# Altium schematic sheet dsPIC33_CPU_ETH100_Unit.SchDoc
size A1
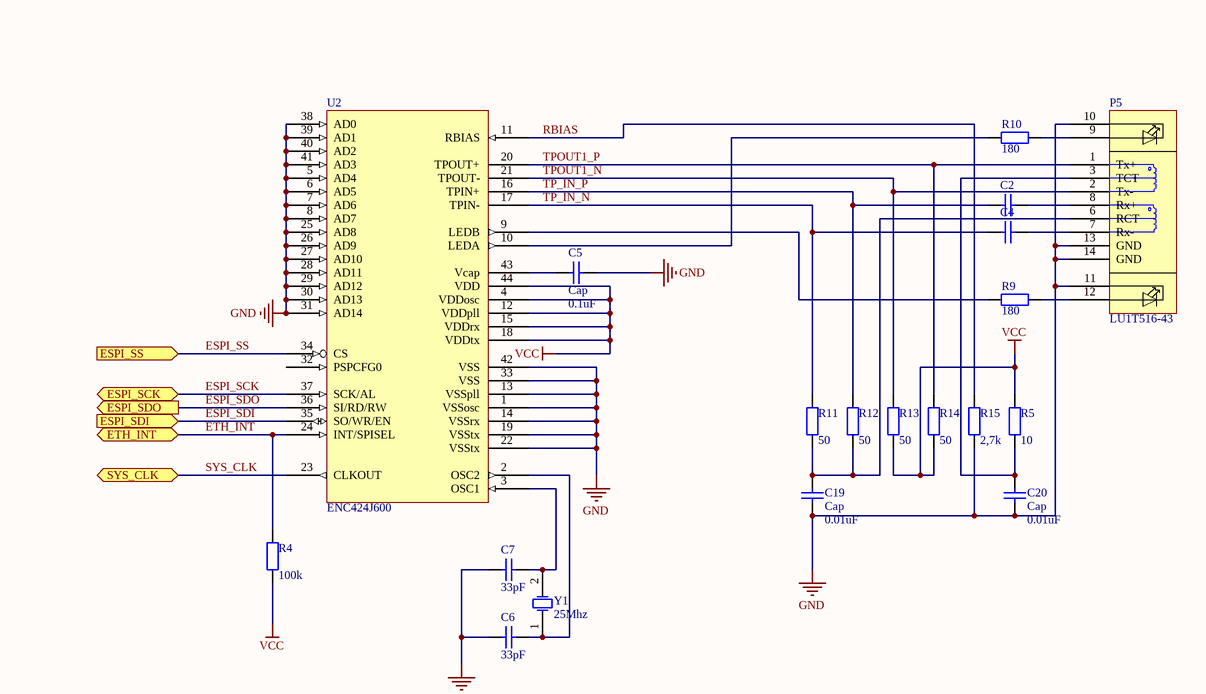
[diagram p0: dsPIC33_CPU_ETH100_Unit.SchDoc, top left]
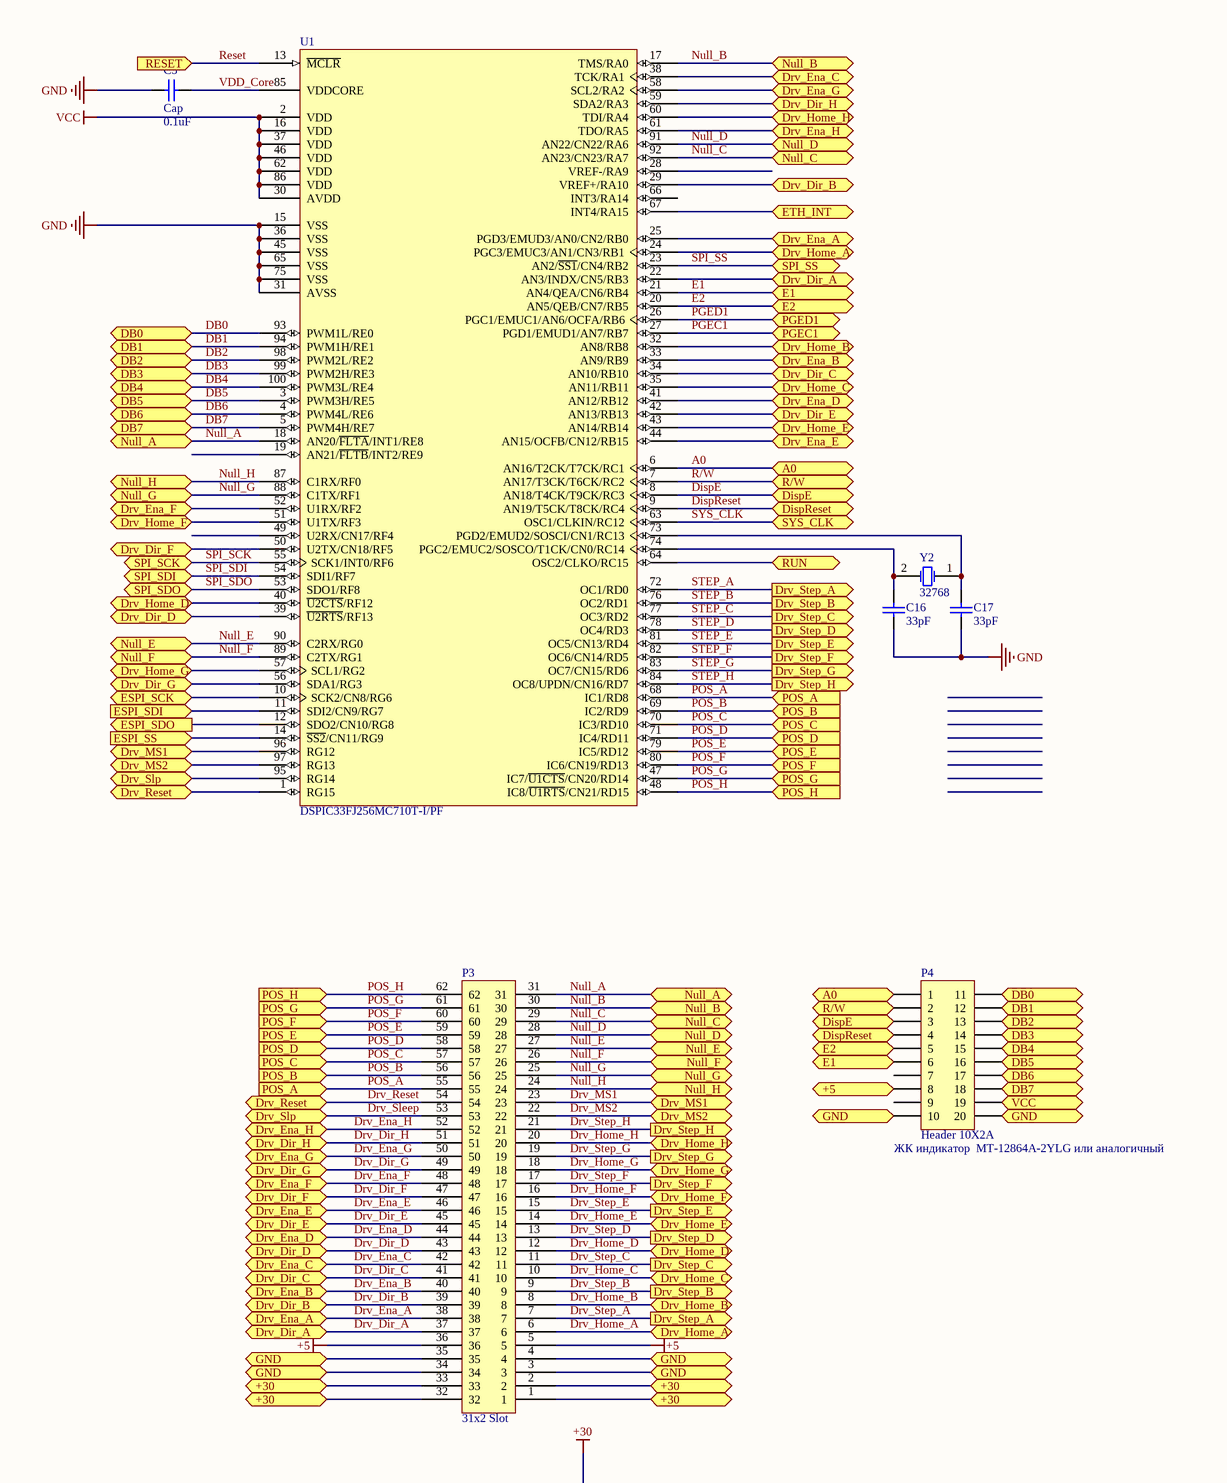
[diagram p1: dsPIC33_CPU_ETH100_Unit.SchDoc, top right]
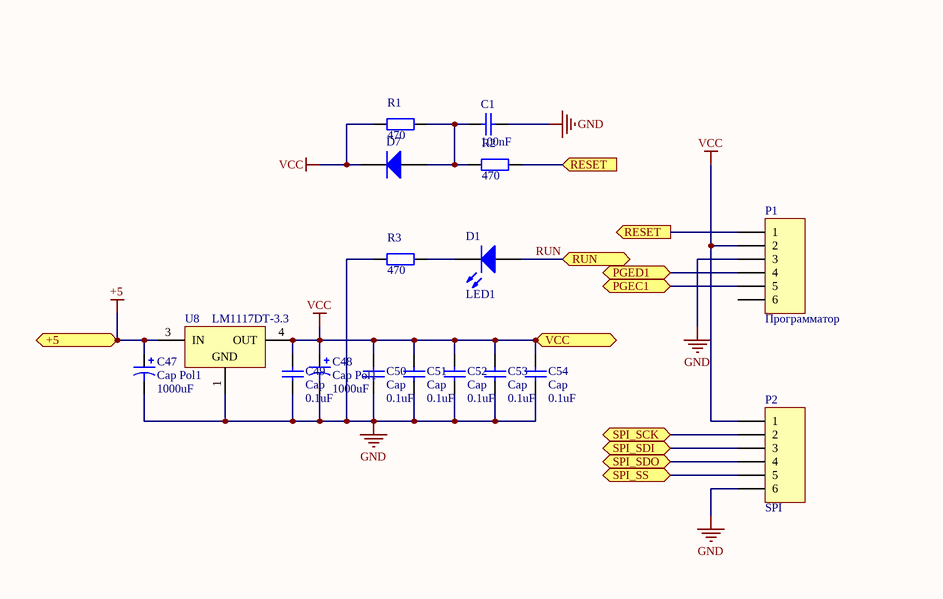
[diagram p2: dsPIC33_CPU_ETH100_Unit.SchDoc, bottom left]
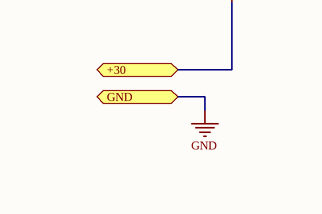
[diagram p3: dsPIC33_CPU_ETH100_Unit.SchDoc, bottom right]

## Parts
C1  value 100nF  [CAPC3225L]  (hidden comment: Cap)
C2  Cap  [CAPC2012L]  (value not drawn)
C3  Cap  value 0.1uF  [CAPC3225L]
C4  Cap  [CAPC2012L]  (value not drawn)
C5  Cap  value 0.1uF  [CAPC3225L]
C6  value 33pF  [CAPC2012L]  (hidden comment: Cap)
C7  value 33pF  [CAPC2012L]  (hidden comment: Cap)
C16  value 33pF  [CAPC2012L]  (hidden comment: Cap)
C17  value 33pF  [CAPC2012L]  (hidden comment: Cap)
C19  Cap  value 0.01uF  [CAPC3225L]
C20  Cap  value 0.01uF  [CAPC3225L]
C47  Cap Pol1  value 1000uF  [CAPPR5-5x5]
C48  Cap Pol1  value 1000uF  [CAPPR5-5x5]
C49  Cap  value 0.1uF  [CAPC3225L]
C50  Cap  value 0.1uF  [CAPC3225L]
C51  Cap  value 0.1uF  [CAPC3225L]
C52  Cap  value 0.1uF  [CAPC3225L]
C53  Cap  value 0.1uF  [CAPC3225L]
C54  Cap  value 0.1uF  [CAPC3225L]
D1  LED1  [LED-1]
D7  Diode  [SOT95P240-3N]  (value not drawn)
P1  Программатор  [HDR1X6]
P2  SPI  [HDR1X6]
P3  31x2 Slot  [SL-62]
P4  Header 10X2A  ConnectTo: ЖК индикатор  MT-12864A-2YLG или аналогичный  [HDR2X10_CEN]
P5  LU1T516-43  [EthernetCON]
R1  value 470  [RESC2012M]  (hidden comment: Res2)
R2  value 470  [RESC2012M]  (hidden comment: Res2)
R3  value 470  [RESC2012M]  (hidden comment: Res2)
R4  value 100k  [RESC2012M]  (hidden comment: Res2)
R5  value 10  [RESC2012M]  (hidden comment: Res2)
R9  value 180  [RESC2012M]  (hidden comment: Res2)
R10  value 180  [RESC2012M]  (hidden comment: Res2)
R11  value 50  [RESC2012M]  (hidden comment: Res2)
R12  value 50  [RESC2012M]  (hidden comment: Res2)
R13  value 50  [RESC2012M]  (hidden comment: Res2)
R14  value 50  [RESC2012M]  (hidden comment: Res2)
R15  value 2,7k  [RESC2012M]  (hidden comment: Res2)
U1  DSPIC33FJ256MC710T-I/PF  [TQFP-PF100_N]
U2  ENC424J600  [TQFP-44_M]
U8  LM1117DT-3.3  [TD03B_N]
Y1  value 25Mhz  [Quartz]  (hidden comment: XTAL)
Y2  value 32768  [Quartz]  (hidden comment: XTAL)

## Ports
+5, +30, A0, DB0, DB1, DB2, DB3, DB4, DB5, DB6, DB7, DispE, DispReset, Drv_Dir_A, Drv_Dir_B, Drv_Dir_C, Drv_Dir_D, Drv_Dir_E, Drv_Dir_F, Drv_Dir_G, Drv_Dir_H, Drv_Ena_A, Drv_Ena_B, Drv_Ena_C, Drv_Ena_D, Drv_Ena_E, Drv_Ena_F, Drv_Ena_G, Drv_Ena_H, Drv_Home_A, Drv_Home_B, Drv_Home_C, Drv_Home_D, Drv_Home_E, Drv_Home_F, Drv_Home_G, Drv_Home_H, Drv_MS1, Drv_MS2, Drv_Reset, Drv_Slp, Drv_Step_A (out), Drv_Step_B (out), Drv_Step_C (out), Drv_Step_D (out), Drv_Step_E (out), Drv_Step_F (out), Drv_Step_G (out), Drv_Step_H (out), E1, E2, ESPI_SCK (bidir), ESPI_SDI (in), ESPI_SDO (out), ESPI_SS (in), ETH_INT, GND, Null_A, Null_B, Null_C, Null_D, Null_E, Null_F, Null_G, Null_H, PGEC1, PGED1, POS_A (in), POS_B (in), POS_C (in), POS_D (in), POS_E (in), POS_F (in), POS_G (in), POS_H (in), R/W, RESET (in), RESET (out), RUN, SPI_SCK (bidir), SPI_SDI (bidir), SPI_SDO (bidir), SPI_SS (bidir), SYS_CLK, VCC

## Nets
+5: C47.1 P3.5 P3.36 P4.8 U8.3(IN) ; port +5
+30: P3.1 P3.2 P3.32 P3.33 ; port +30
GND: C1.1 C3.1 C5.2 C6.2 C7.1 C16.1 C17.2 C19.1 C20.1 C47.2 C48.2 C49.2 C50.2 C51.2 C52.2 C53.2 C54.2 P1.3 P2.6 P3.3 P3.4 P3.34 P3.35 P4.10 P4.20 P5.10 P5.11 P5.13(GND) P5.14(GND) R3.2 R15.1 U1.15(VSS) U1.31(AVSS) U1.36(VSS) U1.45(VSS) U1.65(VSS) U1.75(VSS) U2.1(VSSosc) U2.5(AD4) U2.6(AD5) U2.7(AD6) U2.8(AD7) U2.13(VSSpll) U2.14(VSSrx) U2.19(VSStx) U2.22(VSStx) U2.25(AD8) U2.26(AD9) U2.27(AD10) U2.28(AD11) U2.29(AD12) U2.30(AD13) U2.31(AD14) U2.33(VSS) U2.38(AD0) U2.39(AD1) U2.40(AD2) U2.41(AD3) U2.42(VSS) U8.1(GND) ; port GND
VCC: C48.1 C49.1 C50.1 C51.1 C52.1 C53.1 C54.1 D7.2(K) P1.2 P2.1 P4.19 R1.2 R4.1 R5.2 R13.1 R14.1 U1.2(VDD) U1.16(VDD) U1.30(AVDD) U1.37(VDD) U1.46(VDD) U1.62(VDD) U1.86(VDD) U2.4(VDDosc) U2.12(VDDpll) U2.15(VDDrx) U2.18(VDDtx) U2.44(VDD) U8.4(OUT) ; port VCC
A0: P4.1 U1.6(AN16/T2CK/T7CK/RC1) ; port A0
DB0: P4.11 U1.93(PWM1L/RE0) ; port DB0
DB1: P4.12 U1.94(PWM1H/RE1) ; port DB1
DB2: P4.13 U1.98(PWM2L/RE2) ; port DB2
DB3: P4.14 U1.99(PWM2H/RE3) ; port DB3
DB4: P4.15 U1.100(PWM3L/RE4) ; port DB4
DB5: P4.16 U1.3(PWM3H/RE5) ; port DB5
DB6: P4.17 U1.4(PWM4L/RE6) ; port DB6
DB7: P4.18 U1.5(PWM4H/RE7) ; port DB7
DispE: P4.3 U1.8(AN18/T4CK/T9CK/RC3) ; port DispE
DispReset: P4.4 U1.9(AN19/T5CK/T8CK/RC4) ; port DispReset
Drv_Dir_A: P3.37 U1.22(AN3/INDX/CN5/RB3) ; port Drv_Dir_A
Drv_Dir_B: P3.39 U1.29(VREF+/RA10) ; port Drv_Dir_B
Drv_Dir_C: P3.41 U1.34(AN10/RB10) ; port Drv_Dir_C
Drv_Dir_D: P3.43 U1.39(~{U2RTS}/RF13) ; port Drv_Dir_D
Drv_Dir_E: P3.45 U1.42(AN13/RB13) ; port Drv_Dir_E
Drv_Dir_F: P3.47 U1.50(U2TX/CN18/RF5) ; port Drv_Dir_F
Drv_Dir_G: P3.49 U1.56(SDA1/RG3) ; port Drv_Dir_G
Drv_Dir_H: P3.51 U1.59(SDA2/RA3) ; port Drv_Dir_H
Drv_Ena_A: P3.38 U1.25(PGD3/EMUD3/AN0/CN2/RB0) ; port Drv_Ena_A
Drv_Ena_B: P3.40 U1.33(AN9/RB9) ; port Drv_Ena_B
Drv_Ena_C: P3.42 U1.38(TCK/RA1) ; port Drv_Ena_C
Drv_Ena_D: P3.44 U1.41(AN12/RB12) ; port Drv_Ena_D
Drv_Ena_E: P3.46 U1.44(AN15/OCFB/CN12/RB15) ; port Drv_Ena_E
Drv_Ena_F: P3.48 U1.52(U1RX/RF2) ; port Drv_Ena_F
Drv_Ena_G: P3.50 U1.58(SCL2/RA2) ; port Drv_Ena_G
Drv_Ena_H: P3.52 U1.61(TDO/RA5) ; port Drv_Ena_H
Drv_Home_A: P3.6 U1.24(PGC3/EMUC3/AN1/CN3/RB1) ; port Drv_Home_A
Drv_Home_B: P3.8 U1.32(AN8/RB8) ; port Drv_Home_B
Drv_Home_C: P3.10 U1.35(AN11/RB11) ; port Drv_Home_C
Drv_Home_D: P3.12 U1.40(~{U2CTS}/RF12) ; port Drv_Home_D
Drv_Home_E: P3.14 U1.43(AN14/RB14) ; port Drv_Home_E
Drv_Home_F: P3.16 U1.51(U1TX/RF3) ; port Drv_Home_F
Drv_Home_G: P3.18 U1.57(SCL1/RG2) ; port Drv_Home_G
Drv_Home_H: P3.20 U1.60(TDI/RA4) ; port Drv_Home_H
Drv_MS1: P3.23 U1.96(RG12) ; port Drv_MS1
Drv_MS2: P3.22 U1.97(RG13) ; port Drv_MS2
Drv_Reset: P3.54 U1.1(RG15) ; port Drv_Reset
Drv_Sleep: P3.53 U1.95(RG14) ; port Drv_Slp
Drv_Step_A: P3.7 U1.72(OC1/RD0) ; port Drv_Step_A  [also labelled STEP_A]
Drv_Step_B: P3.9 U1.76(OC2/RD1) ; port Drv_Step_B  [also labelled STEP_B]
Drv_Step_C: P3.11 U1.77(OC3/RD2) ; port Drv_Step_C  [also labelled STEP_C]
Drv_Step_D: P3.13 U1.78(OC4/RD3) ; port Drv_Step_D  [also labelled STEP_D]
Drv_Step_E: P3.15 U1.81(OC5/CN13/RD4) ; port Drv_Step_E  [also labelled STEP_E]
Drv_Step_F: P3.17 U1.82(OC6/CN14/RD5) ; port Drv_Step_F  [also labelled STEP_F]
Drv_Step_G: P3.19 U1.83(OC7/CN15/RD6) ; port Drv_Step_G  [also labelled STEP_G]
Drv_Step_H: P3.21 U1.84(OC8/UPDN/CN16/RD7) ; port Drv_Step_H  [also labelled STEP_H]
E1: P4.6 U1.21(AN4/QEA/CN6/RB4) ; port E1
E2: P4.5 U1.20(AN5/QEB/CN7/RB5) ; port E2
ESPI_SCK: U1.10(SCK2/CN8/RG6) U2.37(SCK/AL) ; port ESPI_SCK
ESPI_SDI: U1.11(SDI2/CN9/RG7) U2.35(SO/WR/EN) ; port ESPI_SDI
ESPI_SDO: U1.12(SDO2/CN10/RG8) U2.36(SI/RD/RW) ; port ESPI_SDO
ESPI_SS: U1.14(~{SS2}/CN11/RG9) U2.34(CS) ; port ESPI_SS
ETH_INT: R4.2 U1.67(INT4/RA15) U2.24(INT/SPISEL) ; port ETH_INT
Null_A: P3.31 U1.18(AN20/~{FLTA}/INT1/RE8) ; port Null_A
Null_B: P3.30 U1.17(TMS/RA0) ; port Null_B
Null_C: P3.29 U1.92(AN23/CN23/RA7) ; port Null_C
Null_D: P3.28 U1.91(AN22/CN22/RA6) ; port Null_D
Null_E: P3.27 U1.90(C2RX/RG0) ; port Null_E
Null_F: P3.26 U1.89(C2TX/RG1) ; port Null_F
Null_G: P3.25 U1.88(C1TX/RF1) ; port Null_G
Null_H: P3.24 U1.87(C1RX/RF0) ; port Null_H
PGEC1: P1.5 U1.27(PGD1/EMUD1/AN7/RB7) ; port PGEC1
PGED1: P1.4 U1.26(PGC1/EMUC1/AN6/OCFA/RB6) ; port PGED1
POS_A: P3.55 U1.68(IC1/RD8) ; port POS_A
POS_B: P3.56 U1.69(IC2/RD9) ; port POS_B
POS_C: P3.57 U1.70(IC3/RD10) ; port POS_C
POS_D: P3.58 U1.71(IC4/RD11) ; port POS_D
POS_E: P3.59 U1.79(IC5/RD12) ; port POS_E
POS_F: P3.60 U1.80(IC6/CN19/RD13) ; port POS_F
POS_G: P3.61 U1.47(IC7/~{U1CTS}/CN20/RD14) ; port POS_G
POS_H: P3.62 U1.48(IC8/~{U1RTS}/CN21/RD15) ; port POS_H
R/W: P4.2 U1.7(AN17/T3CK/T6CK/RC2) ; port R/W
RBIAS: R15.2 U2.11(RBIAS)
Reset: P1.1 R2.1 U1.13(~{MCLR}) ; port RESET
RUN: D1.1(A) U1.64(OSC2/CLKO/RC15) ; port RUN
SPI_SCK: P2.2 U1.55(SCK1/INT0/RF6) ; port SPI_SCK
SPI_SDI: P2.3 U1.54(SDI1/RF7) ; port SPI_SDI
SPI_SDO: P2.4 U1.53(SDO1/RF8) ; port SPI_SDO
SPI_SS: P2.5 U1.23(AN2/~{SS1}/CN4/RB2) ; port SPI_SS
SYS_CLK: U1.63(OSC1/CLKIN/RC12) U2.23(CLKOUT) ; port SYS_CLK
TP_IN_N: C4.2 R11.2 U2.17(TPIN-)
TP_IN_P: C2.2 R12.2 U2.16(TPIN+)
TPOUT1_N: P5.2(Tx-) R13.2 U2.21(TPOUT-)
TPOUT1_P: P5.1(Tx+) R14.2 U2.20(TPOUT+)
VDD_Core: C3.2 U1.85(VDDCORE)
NetC1_2: C1.2 D7.1(A) R1.1 R2.2
NetC2_1: C2.1 P5.8(Rx+)
NetC4_1: C4.1 P5.7(Rx-)
NetC5_1: C5.1 U2.43(Vcap)
NetC6_1: C6.1 U2.2(OSC2) Y1.1(OSC1)
NetC7_2: C7.2 U2.3(OSC1) Y1.2(OSC2)
NetC16_2: C16.2 U1.74(PGC2/EMUC2/SOSCO/T1CK/CN0/RC14) Y2.2(OSC2)
NetC17_1: C17.1 U1.73(PGD2/EMUD2/SOSCI/CN1/RC13) Y2.1(OSC1)
NetC19_2: C19.2 P5.6(RCT) R11.1 R12.1
NetC20_2: C20.2 P5.3(TCT) R5.1
NetD1_2: D1.2(K) R3.1
NetP5_9: P5.9 R10.2
NetP5_12: P5.12 R9.2
NetR9_1: R9.1 U2.9(LEDB)
NetR10_1: R10.1 U2.10(LEDA)

Not connected (* = marked no-connect by the designer): P1 6; P4 7 9; U1 19(AN21/~{FLTB}/INT2/RE9) 28(VREF-/RA9) 49(U2RX/CN17/RF4) 66(INT3/RA14); U2 32(PSPCFG0)

## Library data of the parts
C1 C3 C5-C7 C16 C17 C19 C20 C49-C54 = Cap: Capacitor; Published: 8-Jun-2000; LatestRevisionDate: 17-Jul-2002; LatestRevisionNote: Re-released for DXP Platform.; PackageReference: RAD-0.3; Publisher: Altium Limited
C2 C4 = Cap: Capacitor; Value: 6.8nF 10%; Published: 8-Jun-2000; LatestRevisionDate: 17-Jul-2002; LatestRevisionNote: Re-released for DXP Platform.; PackageReference: RAD-0.3; Publisher: Altium Limited
C47 C48 = Cap Pol1: Polarized Capacitor (Radial); Published: 8-Jun-2000; LatestRevisionDate: 17-Jul-2002; LatestRevisionNote: Re-released for DXP Platform.; PackageReference: RB7.6-15; Publisher: Altium Limited
D1 = LED1: Typical RED GaAs LED; Published: 8-Jun-2000; LatestRevisionDate: 08-Jul-2005; LatestRevisionNote: Mech Layer 1 removed.; PackageReference: LED-1; Publisher: Altium Limited
D7 = Diode: Default Diode; Published: 8-Jun-2000; LatestRevisionDate: 17-Jul-2002; LatestRevisionNote: Re-released for DXP Platform.; PackageVersion: Sep-1996; PackageReference: SMC; Publisher: Altium Limited; Code_JEDEC: DO-214-AB
P1 P2 = Header 6: Header, 6-Pin; LatestRevisionDate: 17-Jul-2002; LatestRevisionNote: Re-released for DXP Platform.; Publisher: Altium Limited
P4 = Header 10X2A: Header, 10-Pin, Dual row; LatestRevisionDate: 17-Jul-2002; LatestRevisionNote: Re-released for DXP Platform.; Publisher: Altium Limited
R1-R5 R9-R15 = Res2: Resistor; Published: 8-Jun-2000; LatestRevisionDate: 17-Jul-2002; LatestRevisionNote: Re-released for DXP Platform.; PackageReference: AXIAL-0.4; Publisher: Altium Limited
U1 = DSPIC33FJ256MC710T-I/PF: High-Performance 16-bit Digital Signal Controller, 256 KB Flash, 30 KB RAM, 100-Pin TQFP, Industrial Temperature, Tape and Reel; Published: 29-Jan-2009; DatasheetVersion: revA, Jun-2007; PackageVersion: revAW, Oct-2008; PackageReference: TQFP-PF100; Publisher: Altium Limited; PackageDescription: 100-Lead Thin Plastic Quad Flat Pack (PF) - 14x14x1mm Body, 2.00mm [TQFP]; ComponentLink1Description: Manufacturer Link; ComponentLink1URL: http://www.microchip.com; ComponentLink2Description: Datasheet; ComponentLink2URL: http://ww1.microchip.com/downloads/en/DeviceDoc/70287A.pdf; ComponentLink3Description: Packaging Specification; ComponentLink3URL: http://ww1.microchip.com/downloads/en/PackagingSpec/00049AW.pdf
U8 = LM1117DT-3.3: 800mA Low-Dropout Linear Regulator; Manufacturer: National Semiconductor; CompType: LDO IC; PackageTopMarking: NSUZXYTT*LM1117*DT-3.3; PowerWise: N; Published: 4-Dec-2008; DatasheetVersion: Apr-2006; PackageVersion: revC, Apr-2003; PackageReference: TD03B; Publisher: Altium Limited; PackageDescription: TO252, Molded, Jedec, 6.8 x 6.10 x 2.30mm Body, 3 Lead, 2.28mm Pitch, Surface Mount; PartNumber: LM1117DT-3.3; RoHS: O; PinCount: 3; DigiKeyPartNumber: LM1117DT-3.3-ND; Code_JEDEC: TO-252-AA; ComponentLink1Description: LM1117 Datasheet; ComponentLink1URL: http://www.national.com/ds/LM/LM1117.pdf; ComponentLink2Description: LM1117 Web Page; ComponentLink2URL: http://www.national.com/pf/LM/LM1117.html; ComponentLink3Description: TD03B Package Page; ComponentLink3URL: http://www.national.com/packaging/folders/td03b.html
Y1 Y2 = XTAL: Crystal Oscillator; Published: 8-Jun-2000; LatestRevisionDate: 17-Jul-2002; LatestRevisionNote: Re-released for DXP Platform.; PackageReference: R38; Publisher: Altium Limited